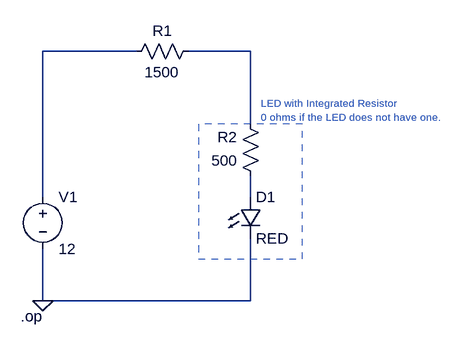
[diagram p0: schematic LED Series Resistor.asc]
LED Series Resistor.asc, the LTspice schematic file:
Version 4
SHEET 1 1140 680
WIRE 96 16 -48 16
WIRE 272 16 176 16
WIRE 272 128 272 16
WIRE -48 240 -48 16
WIRE 272 240 272 208
WIRE -48 400 -48 320
WIRE 272 400 272 304
WIRE 272 400 -48 400
FLAG -48 400 0
DATAFLAG 272 80 "round(I(R1)*1k)/1k"
SYMBOL LED 256 240 R0
SYMATTR InstName D1
SYMATTR Value RED
SYMBOL voltage -48 224 R0
WINDOW 123 0 0 Left 0
WINDOW 39 24 124 Left 2
SYMATTR InstName V1
SYMATTR Value 12
SYMBOL res 192 0 R90
WINDOW 0 0 56 VBottom 2
WINDOW 3 32 56 VTop 2
SYMATTR InstName R1
SYMATTR Value 1500
SYMBOL res 288 224 R180
WINDOW 0 36 76 Left 2
WINDOW 3 36 40 Left 2
SYMATTR InstName R2
SYMATTR Value 500
TEXT -82 424 Left 2 !.op
TEXT 288 96 Left 1 ;LED with Integrated Resistor\n0 ohms if the LED does not have one.
RECTANGLE Normal 192 336 352 128 1

The netlist it stands for:
* LED Series Resistor.asc
D1 N003 0 RED
V1 N001 0 12
R1 N002 N001 1500
R2 N003 N002 500
.model D D
.lib standard.dio
.op
* LED with Integrated Resistor
* 0 ohms if the LED does not have one.
.backanno
.end